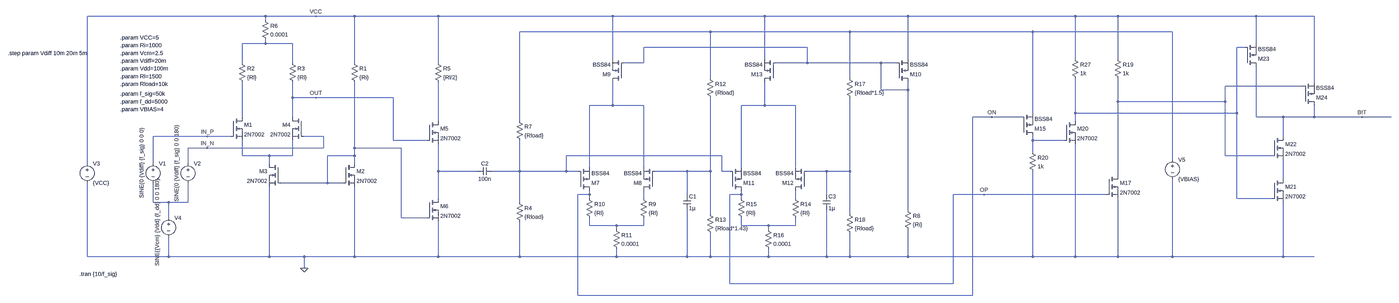
[diagram p0: schematic sense_amp2.asc, whole sheet]
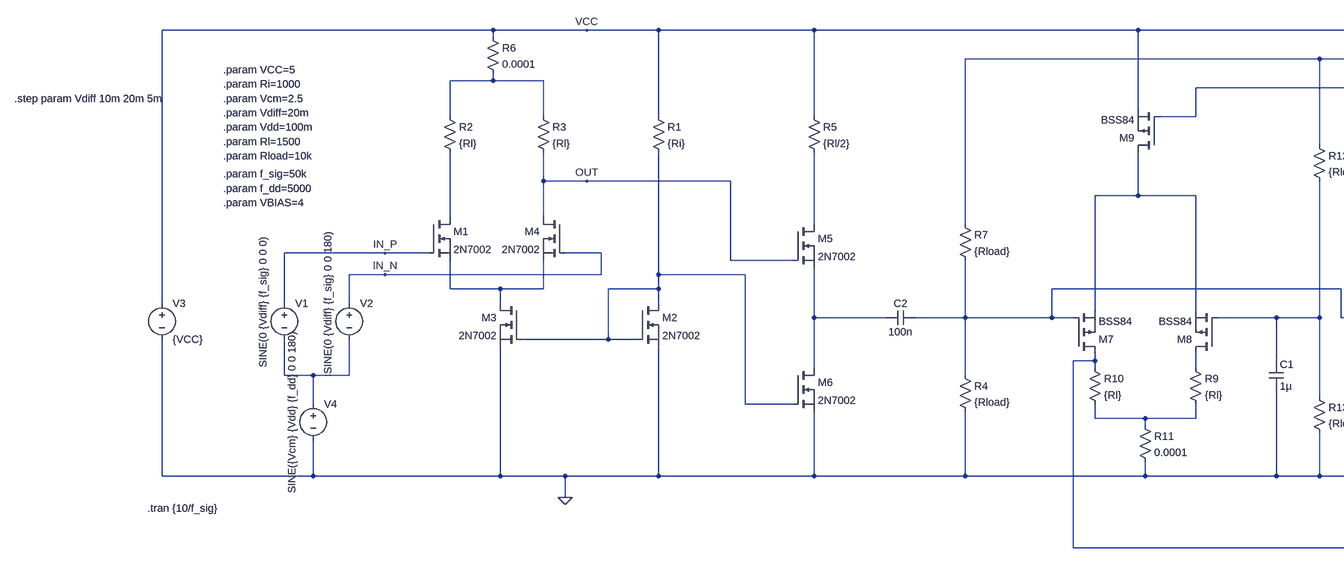
[diagram p1: schematic sense_amp2.asc, part, row 1 of 1, column 1 of 2]
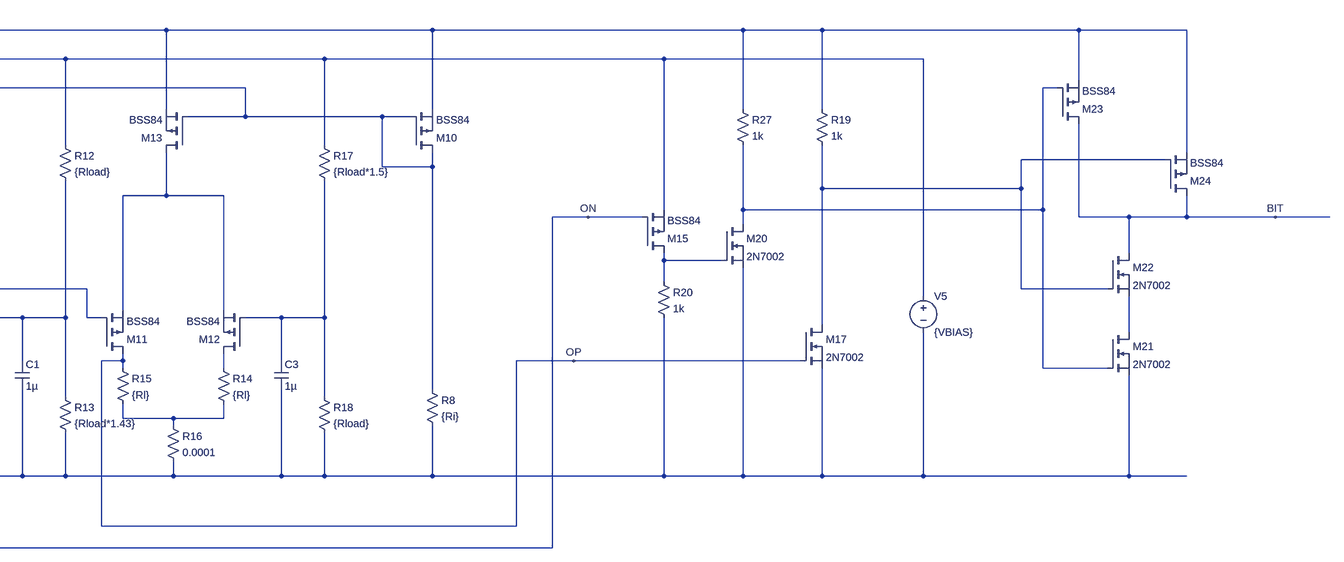
[diagram p2: schematic sense_amp2.asc, part, row 1 of 1, column 2 of 2]
sense_amp2.asc, the LTspice schematic file:
Version 4
SHEET 1 5492 944
WIRE 288 -272 -448 -272
WIRE 496 -272 288 -272
WIRE 656 -272 496 -272
WIRE 1040 -272 656 -272
WIRE 1760 -272 1040 -272
WIRE 2432 -272 1760 -272
WIRE 3024 -272 2432 -272
WIRE 3808 -272 3024 -272
WIRE 3984 -272 3808 -272
WIRE 4768 -272 3984 -272
WIRE 5008 -272 4768 -272
WIRE 288 -256 288 -272
WIRE 2208 -208 1376 -208
WIRE 2784 -208 2208 -208
WIRE 3632 -208 2784 -208
WIRE 4336 -208 3632 -208
WIRE 288 -160 288 -176
WIRE 288 -160 192 -160
WIRE 400 -160 288 -160
WIRE 4768 -160 4768 -272
WIRE 2608 -144 1888 -144
WIRE 4720 -144 4688 -144
WIRE 1760 -96 1760 -272
WIRE 2432 -96 2432 -272
WIRE 3024 -96 3024 -272
WIRE 3808 -96 3808 -272
WIRE 3984 -96 3984 -272
WIRE 192 -80 192 -160
WIRE 400 -80 400 -160
WIRE 656 -80 656 -272
WIRE 1040 -80 1040 -272
WIRE 1888 -80 1888 -144
WIRE 1888 -80 1808 -80
WIRE 2608 -80 2608 -144
WIRE 2608 -80 2480 -80
WIRE 2912 -80 2608 -80
WIRE 2976 -80 2912 -80
WIRE 2208 -16 2208 -208
WIRE 2784 -16 2784 -208
WIRE 5008 0 5008 -272
WIRE 4960 16 4640 16
WIRE 2912 32 2912 -80
WIRE 3024 32 3024 0
WIRE 3024 32 2912 32
WIRE 400 64 400 0
WIRE 496 64 400 64
WIRE 816 64 496 64
WIRE 3984 80 3984 -16
WIRE 4640 80 4640 16
WIRE 4640 80 3984 80
WIRE 1760 96 1760 0
WIRE 1760 96 1664 96
WIRE 1888 96 1760 96
WIRE 2432 96 2432 0
WIRE 2432 96 2336 96
WIRE 2560 96 2432 96
WIRE 3632 128 3632 -208
WIRE 3808 128 3808 -16
WIRE 4688 128 4688 -144
WIRE 4688 128 3808 128
WIRE 192 144 192 0
WIRE 400 144 400 64
WIRE 3392 144 3312 144
WIRE 3584 144 3392 144
WIRE 4768 144 4768 -64
WIRE 4880 144 4768 144
WIRE 5008 144 5008 96
WIRE 5008 144 4880 144
WIRE 5232 144 5008 144
WIRE 5488 144 5232 144
WIRE 1040 160 1040 0
WIRE 1376 160 1376 -208
WIRE 3808 160 3808 128
WIRE 48 224 -176 224
WIRE 144 224 48 224
WIRE 528 224 448 224
WIRE 4880 224 4880 144
WIRE 816 240 816 64
WIRE 992 240 816 240
WIRE 3632 240 3632 224
WIRE 3760 240 3632 240
WIRE 48 272 -32 272
WIRE 528 272 528 224
WIRE 528 272 48 272
WIRE 656 272 656 0
WIRE 848 272 656 272
WIRE 3632 288 3632 240
WIRE 192 304 192 240
WIRE 304 304 192 304
WIRE 400 304 400 240
WIRE 400 304 304 304
WIRE 656 304 656 272
WIRE 656 304 544 304
WIRE 2256 304 1568 304
WIRE 4640 304 4640 80
WIRE 4832 304 4640 304
WIRE 4336 320 4336 -208
WIRE -448 336 -448 -272
WIRE -176 336 -176 224
WIRE -32 336 -32 272
WIRE 304 336 304 304
WIRE 656 336 656 304
WIRE 1664 352 1664 96
WIRE 1888 352 1888 96
WIRE 2336 352 2336 96
WIRE 2560 352 2560 96
WIRE 1040 368 1040 256
WIRE 1200 368 1040 368
WIRE 1376 368 1376 240
WIRE 1376 368 1264 368
WIRE 1568 368 1568 304
WIRE 1568 368 1376 368
WIRE 1616 368 1568 368
WIRE 2112 368 1936 368
WIRE 2208 368 2208 64
WIRE 2208 368 2112 368
WIRE 2256 368 2256 304
WIRE 2288 368 2256 368
WIRE 2688 368 2608 368
WIRE 2784 368 2784 64
WIRE 2784 368 2688 368
WIRE 3984 384 3984 80
WIRE 4880 400 4880 320
WIRE 544 416 544 304
WIRE 544 416 352 416
WIRE 608 416 544 416
WIRE 1664 464 1664 448
WIRE 1664 464 1616 464
WIRE 2112 464 2112 368
WIRE 2336 464 2336 448
WIRE 2336 464 2288 464
WIRE 2688 464 2688 368
WIRE 3360 464 3232 464
WIRE 3936 464 3360 464
WIRE 1040 480 1040 368
WIRE 1664 480 1664 464
WIRE 1888 480 1888 448
WIRE 2336 480 2336 464
WIRE 2560 480 2560 448
WIRE 4688 480 4688 128
WIRE 4832 480 4688 480
WIRE -176 496 -176 416
WIRE -112 496 -176 496
WIRE -32 496 -32 416
WIRE -32 496 -112 496
WIRE 1376 496 1376 368
WIRE 3024 528 3024 32
WIRE 2208 544 2208 368
WIRE 2784 544 2784 368
WIRE -112 560 -112 496
WIRE 848 560 848 272
WIRE 992 560 848 560
WIRE 1664 592 1664 560
WIRE 1776 592 1664 592
WIRE 1888 592 1888 560
WIRE 1888 592 1776 592
WIRE 2336 592 2336 560
WIRE 2448 592 2336 592
WIRE 2560 592 2560 560
WIRE 2560 592 2448 592
WIRE 1776 608 1776 592
WIRE 2448 608 2448 592
WIRE -448 720 -448 416
WIRE -112 720 -112 640
WIRE -112 720 -448 720
WIRE 304 720 304 432
WIRE 304 720 -112 720
WIRE 448 720 304 720
WIRE 656 720 656 432
WIRE 656 720 448 720
WIRE 1040 720 1040 576
WIRE 1040 720 656 720
WIRE 1376 720 1376 576
WIRE 1376 720 1040 720
WIRE 1776 720 1776 688
WIRE 1776 720 1376 720
WIRE 2112 720 2112 528
WIRE 2112 720 1776 720
WIRE 2208 720 2208 624
WIRE 2208 720 2112 720
WIRE 2448 720 2448 688
WIRE 2448 720 2208 720
WIRE 2688 720 2688 528
WIRE 2688 720 2448 720
WIRE 2784 720 2784 624
WIRE 2784 720 2688 720
WIRE 3024 720 3024 608
WIRE 3024 720 2784 720
WIRE 3632 720 3632 368
WIRE 3632 720 3024 720
WIRE 3808 720 3808 256
WIRE 3808 720 3632 720
WIRE 3984 720 3984 480
WIRE 3984 720 3808 720
WIRE 4336 720 4336 400
WIRE 4336 720 3984 720
WIRE 4880 720 4880 496
WIRE 4880 720 4336 720
WIRE 5008 720 4880 720
WIRE 448 768 448 720
WIRE 2288 832 2288 464
WIRE 3232 832 3232 464
WIRE 3232 832 2288 832
WIRE 1616 880 1616 464
WIRE 3312 880 3312 144
WIRE 3312 880 1616 880
FLAG 496 64 OUT
FLAG 448 768 0
FLAG 48 224 IN_P
FLAG 48 272 IN_N
FLAG 496 -272 VCC
FLAG 3360 464 OP
FLAG 3392 144 ON
FLAG 5232 144 BIT
SYMBOL nmos 144 144 R0
SYMATTR InstName M1
SYMATTR Value 2N7002
SYMBOL res 640 -96 R0
SYMATTR InstName R1
SYMATTR Value {Ri}
SYMBOL nmos 608 336 R0
SYMATTR InstName M2
SYMATTR Value 2N7002
SYMBOL nmos 352 336 M0
SYMATTR InstName M3
SYMATTR Value 2N7002
SYMBOL nmos 448 144 M0
SYMATTR InstName M4
SYMATTR Value 2N7002
SYMBOL voltage -176 320 R0
WINDOW 3 -47 -133 VRight 2
WINDOW 123 0 0 Left 0
WINDOW 39 0 0 Left 0
SYMATTR Value SINE(0 {Vdiff} {f_sig} 0 0 0)
SYMATTR InstName V1
SYMBOL voltage -32 320 R0
WINDOW 3 -47 -145 VRight 2
WINDOW 123 0 0 Left 0
WINDOW 39 0 0 Left 0
SYMATTR Value SINE(0 {Vdiff} {f_sig} 0 0 180)
SYMATTR InstName V2
SYMBOL voltage -448 320 R0
WINDOW 123 0 0 Left 0
WINDOW 39 0 0 Left 0
SYMATTR InstName V3
SYMATTR Value {VCC}
SYMBOL cap 1264 352 R90
WINDOW 0 0 32 VBottom 2
WINDOW 3 32 32 VTop 2
SYMATTR InstName C2
SYMATTR Value 100n
SYMBOL voltage -112 544 R0
WINDOW 3 -47 -145 VRight 2
WINDOW 123 0 0 Left 0
WINDOW 39 0 0 Left 0
SYMATTR Value SINE({Vcm} {Vdd} {f_dd} 0 0 180)
SYMATTR InstName V4
SYMBOL res 176 -96 R0
SYMATTR InstName R2
SYMATTR Value {Rl}
SYMBOL res 384 -96 R0
SYMATTR InstName R3
SYMATTR Value {Rl}
SYMBOL res 1024 -96 R0
SYMATTR InstName R5
SYMATTR Value {Rl/2}
SYMBOL nmos 992 480 R0
SYMATTR InstName M6
SYMATTR Value 2N7002
SYMBOL res 272 -272 R0
SYMATTR InstName R6
SYMATTR Value 0.0001
SYMBOL nmos 992 160 R0
SYMATTR InstName M5
SYMATTR Value 2N7002
SYMBOL res 1360 480 R0
SYMATTR InstName R4
SYMATTR Value {Rload}
SYMBOL res 1360 144 R0
SYMATTR InstName R7
SYMATTR Value {Rload}
SYMBOL pmos 1616 448 M180
SYMATTR InstName M7
SYMATTR Value BSS84
SYMBOL pmos 1936 448 R180
SYMATTR InstName M8
SYMATTR Value BSS84
SYMBOL pmos 1808 0 R180
SYMATTR InstName M9
SYMATTR Value BSS84
SYMBOL pmos 2976 0 M180
SYMATTR InstName M10
SYMATTR Value BSS84
SYMBOL res 3008 512 R0
SYMATTR InstName R8
SYMATTR Value {Ri}
SYMBOL res 1872 464 R0
SYMATTR InstName R9
SYMATTR Value {Rl}
SYMBOL res 1648 464 R0
SYMATTR InstName R10
SYMATTR Value {Rl}
SYMBOL res 1760 592 R0
SYMATTR InstName R11
SYMATTR Value 0.0001
SYMBOL res 2192 -32 R0
SYMATTR InstName R12
SYMATTR Value {Rload}
SYMBOL res 2192 528 R0
SYMATTR InstName R13
SYMATTR Value {Rload*1.43}
SYMBOL cap 2096 464 R0
SYMATTR InstName C1
SYMATTR Value 1µ
SYMBOL pmos 2288 448 M180
SYMATTR InstName M11
SYMATTR Value BSS84
SYMBOL pmos 2608 448 R180
SYMATTR InstName M12
SYMATTR Value BSS84
SYMBOL pmos 2480 0 R180
SYMATTR InstName M13
SYMATTR Value BSS84
SYMBOL res 2544 464 R0
SYMATTR InstName R14
SYMATTR Value {Rl}
SYMBOL res 2320 464 R0
SYMATTR InstName R15
SYMATTR Value {Rl}
SYMBOL res 2432 592 R0
SYMATTR InstName R16
SYMATTR Value 0.0001
SYMBOL res 2768 -32 R0
SYMATTR InstName R17
SYMATTR Value {Rload*1.5}
SYMBOL res 2768 528 R0
SYMATTR InstName R18
SYMATTR Value {Rload}
SYMBOL cap 2672 464 R0
SYMATTR InstName C3
SYMATTR Value 1µ
SYMBOL pmos 3584 224 M180
SYMATTR InstName M15
SYMATTR Value BSS84
SYMBOL res 3968 -112 R0
SYMATTR InstName R19
SYMATTR Value 1k
SYMBOL res 3616 272 R0
SYMATTR InstName R20
SYMATTR Value 1k
SYMBOL voltage 4336 304 R0
WINDOW 123 0 0 Left 0
WINDOW 39 0 0 Left 0
SYMATTR InstName V5
SYMATTR Value {VBIAS}
SYMBOL nmos 3936 384 R0
SYMATTR InstName M17
SYMATTR Value 2N7002
SYMBOL nmos 3760 160 R0
SYMATTR InstName M20
SYMATTR Value 2N7002
SYMBOL res 3792 -112 R0
SYMATTR InstName R27
SYMATTR Value 1k
SYMBOL nmos 4832 400 R0
SYMATTR InstName M21
SYMATTR Value 2N7002
SYMBOL nmos 4832 224 R0
SYMATTR InstName M22
SYMATTR Value 2N7002
SYMBOL pmos 4720 -64 M180
SYMATTR InstName M23
SYMATTR Value BSS84
SYMBOL pmos 4960 96 M180
SYMATTR InstName M24
SYMATTR Value BSS84
TEXT -480 792 Left 2 !.tran {10/f_sig}
TEXT -312 -184 Left 2 !.param VCC=5
TEXT -312 -152 Left 2 !.param Ri=1000
TEXT -312 -120 Left 2 !.param Vcm=2.5
TEXT -312 -88 Left 2 !.param Vdiff=20m
TEXT -776 -120 Left 2 !.step param Vdiff 10m 20m 5m
TEXT -312 -56 Left 2 !.param Vdd=100m
TEXT -312 -24 Left 2 !.param Rl=1500
TEXT -312 8 Left 2 !.param Rload=10k
TEXT -312 48 Left 2 !.param f_sig=50k
TEXT -312 80 Left 2 !.param f_dd=5000
TEXT -312 112 Left 2 !.param VBIAS=4

The netlist it stands for:
* sense_amp2.asc
M1 N008 IN_P N012 N012 2N7002
R1 VCC N011 {Ri}
M2 N011 N011 0 0 2N7002
M3 N012 N011 0 0 2N7002
M4 OUT IN_N N012 N012 2N7002
V1 IN_P N020 SINE(0 {Vdiff} {f_sig} 0 0 0)
V2 IN_N N020 SINE(0 {Vdiff} {f_sig} 0 0 180)
V3 VCC 0 {VCC}
C2 N013 N014 100n
V4 N020 0 SINE({Vcm} {Vdd} {f_dd} 0 0 180)
R2 N002 N008 {Rl}
R3 N002 OUT {Rl}
R5 VCC N009 {Rl/2}
M6 N014 N011 0 0 2N7002
R6 VCC N002 0.0001
M5 N009 OUT N014 N014 2N7002
R4 N013 0 {Rload}
R7 N001 N013 {Rload}
M7 ON N013 N006 N006 BSS84
M8 N018 N015 N006 N006 BSS84
M9 N006 N003 VCC VCC BSS84
M10 N003 N003 VCC VCC BSS84
R8 N003 0 {Ri}
R9 N018 N021 {Rl}
R10 ON N021 {Rl}
R11 N021 0 0.0001
R12 N001 N015 {Rload}
R13 N015 0 {Rload*1.43}
C1 N015 0 1µ
M11 OP N013 N007 N007 BSS84
M12 N019 N016 N007 N007 BSS84
M13 N007 N003 VCC VCC BSS84
R14 N019 N022 {Rl}
R15 OP N022 {Rl}
R16 N022 0 0.0001
R17 N001 N016 {Rload*1.5}
R18 N016 0 {Rload}
C3 N016 0 1µ
M15 N010 ON N001 N001 BSS84
R19 VCC N005 1k
R20 N010 0 1k
V5 N001 0 {VBIAS}
M17 N005 OP 0 0 2N7002
M20 N004 N010 0 0 2N7002
R27 VCC N004 1k
M21 N017 N004 0 0 2N7002
M22 BIT N005 N017 N017 2N7002
M23 BIT N004 VCC VCC BSS84
M24 BIT N005 VCC VCC BSS84
.model NMOS NMOS
.model PMOS PMOS
.lib standard.mos
.tran {10/f_sig}
.param VCC=5
.param Ri=1000
.param Vcm=2.5
.param Vdiff=20m
.step param Vdiff 10m 20m 5m
.param Vdd=100m
.param Rl=1500
.param Rload=10k
.param f_sig=50k
.param f_dd=5000
.param VBIAS=4
.backanno
.end